# Altium schematic sheet 1.Устройство_Проверки_DI_DO_АКРОС_v1.0.SchDoc
size 420 x 297 mm; SheetNumber: 1; SheetTotal: 1
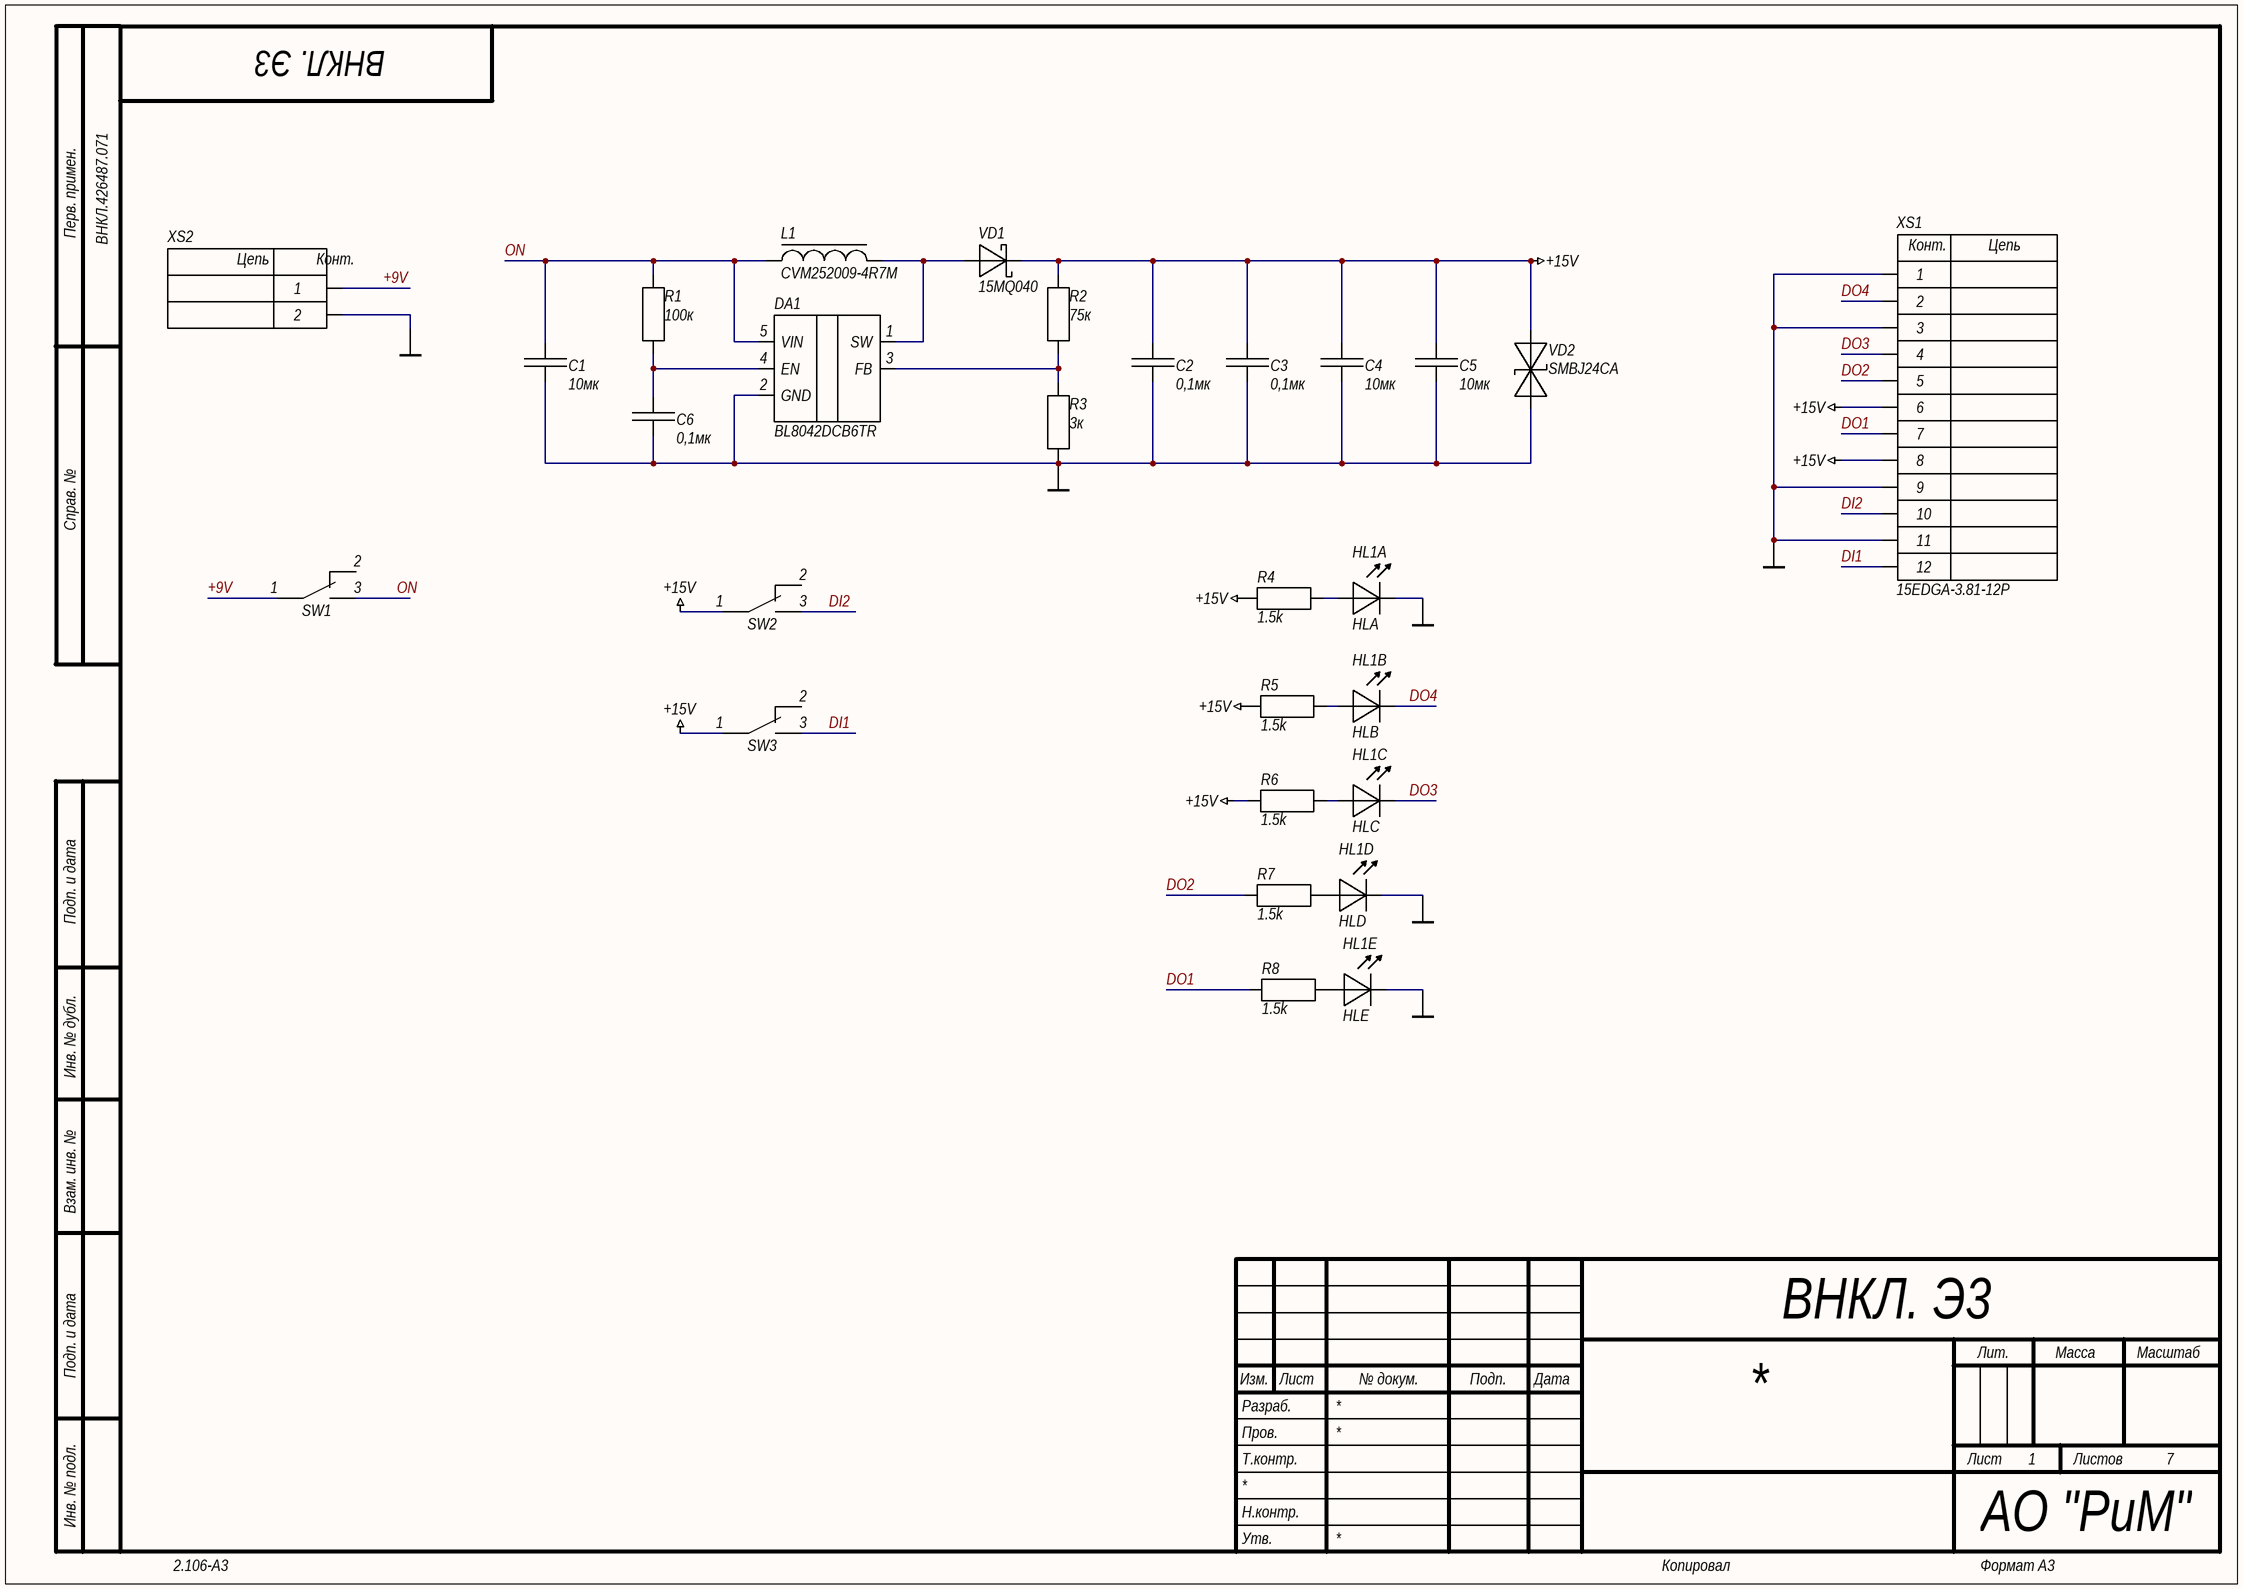
[diagram p0: 1.Устройство_Проверки_DI_DO_АКРОС_v1.0.SchDoc]

## Parts
C1  10мк  [CAP: 0805]
C2  0,1мк  [CAP: 0402]
C3  0,1мк  [CAP: 0402]
C4  10мк  [CAP: 0805]
C5  10мк  [CAP: 0805]
C6  0,1мк  [CAP: 0402]
DA1  BL8042DCB6TR  [SOT23-6]
HL1  HLA  [L-914GDT]  (parts A,B,C,D,E of 5)
L1  CVM252009-4R7M  [IND: 1008]
R1  100к  [RES: 0402]
R2  75к  [RES: 0402]
R3  3к  [RES: 0402]
R4  1.5k  [RES: 0402]
R5  1.5k  [RES: 0402]
R6  1.5k  [RES: 0402]
R7  1.5k  [RES: 0402]
R8  1.5k  [RES: 0402]
SW1  Button-kcd11-102  [BUT: kcd11-102]  (value not drawn)
SW2  Button-kcd11-102  [BUT: kcd11-102]  (value not drawn)
SW3  Button-kcd11-102  [BUT: kcd11-102]  (value not drawn)
VD1  15MQ040  [DIODE: SMA]
VD2  SMBJ24CA  [DIODE: SMB]
XS1  15EDGA-3.81-12P  [CON: 15EDGA-3.81-12P]
XS2  XS?  [BAT: Krona]  (value not drawn)

## Nets
+15V: C2.1 C3.1 C4.1 C5.1 R2.2 R4.1 R5.1 R6.1 SW2.1 SW3.1 VD1.2 VD2.1(A) XS1.6 XS1.8
GND: C1.2 C2.2 C3.2 C4.2 C5.2 C6.2 DA1.2(GND) HL1.1(C) HL1.7(C) HL1.9(C) R3.1 VD2.2(C) XS1.1 XS1.3 XS1.9 XS1.11 XS2.2
+9V: SW1.1 XS2.1
DI1: SW3.3 XS1.12
DI2: SW2.3 XS1.10
DO1: R8.2 XS1.7
DO2: R7.2 XS1.5
DO3: HL1.5(C) XS1.4
DO4: HL1.3(C) XS1.2
ON: C1.1 DA1.5(VIN) L1.2 R1.2 SW1.3
NetC6_1: C6.1 DA1.4(EN) R1.1
NetDA1_1: DA1.1(SW) L1.1 VD1.1
NetDA1_3: DA1.3(FB) R2.1 R3.2
NetHL1_2: HL1.2(A) R4.2
NetHL1_4: HL1.4(A) R5.2
NetHL1_6: HL1.6(A) R6.2
NetHL1_8: HL1.8(A) R7.1
NetHL1_10: HL1.10(A) R8.1

Not connected (* = marked no-connect by the designer): SW1 2; SW2 2; SW3 2

## Notes on the sheet
- ВНКЛ. Э3
- ВНКЛ.426487.071
- Перв. примен.
- Справ. №
- Подп. и дата
- Инв. № дубл.
- Взам. инв. №
- Разраб.
- Изм.
- Лист
- № докум.
- Подп.
- Дата
- Лит.
- Масса
- Масштаб
- Пров.
- Т.контр.
- Листов
- 7
- Инв. № подл.
- Утв.
- Н.контр.
- АО "РиМ"
- 2.106-A3
- Копировал
- Формат А3
- (in symbol CONNECTOR-12 - 3,81mm) Конт.; Цепь
- (in symbol Connector_Krona) Цепь; Конт.

## Library data of the parts
C1 C4 C5 = Ceramic_0805: Наименование: 0805 X5R 16В 10 мкФ ±10%; Примечание: SMD
C2 C3 C6 = Ceramic_0402: Наименование: 0402 X7R 25В 0,1 мкФ ±10%; Примечание: SMD
DA1 = BL8042DCB6TR: Boost converter; Наименование: BL8032CB6TR; Примечание: SMD
HL1 = L-914GDT
L1 = CVM252009: Примечание: SMD; Наименование: CVM252009-4R7M
R1-R8 = Resistor_0402: Наименование: 0402 100 кОм ±1%; Примечание: SMD
VD1 = Schottky_single: Наименование: MBR0520; Примечание: SMD
VD2 = TVS_single: Наименование: 1N4148; Примечание: SMD
XS1 = CONNECTOR-12 - 3,81mm
XS2 = Connector_Krona